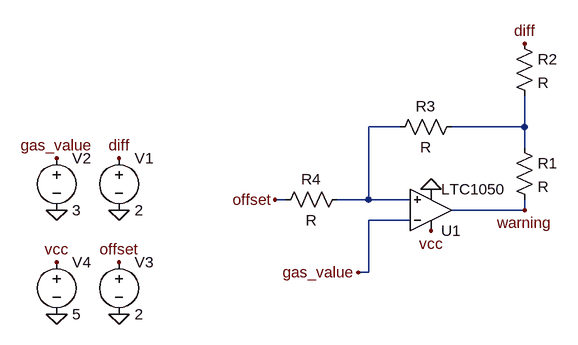
[diagram p0: schematic Draft2.asc]
Draft2.asc, the LTspice schematic file:
Version 4
SHEET 1 880 680
WIRE 160 -16 112 -16
WIRE 352 -16 352 -64
WIRE 352 -16 240 -16
WIRE 352 16 352 -16
WIRE -16 96 -32 96
WIRE 112 96 112 -16
WIRE 112 96 64 96
WIRE 176 96 112 96
WIRE 352 112 352 96
WIRE 352 112 240 112
WIRE 176 128 112 128
WIRE 112 208 112 128
WIRE 112 208 96 208
FLAG 96 208 gas_value
FLAG -32 96 offset
FLAG 352 -144 diff
FLAG 352 112 warning
FLAG -272 112 0
FLAG -272 32 diff
FLAG -368 112 0
FLAG -368 32 gas_value
FLAG -272 272 0
FLAG -272 192 offset
FLAG -368 272 0
FLAG -368 192 vcc
FLAG 208 144 vcc
FLAG 208 80 0
SYMBOL Opamps\\LTC1050 208 176 M180
SYMATTR InstName U1
SYMBOL res 336 0 R0
SYMATTR InstName R1
SYMBOL res 336 -160 R0
SYMATTR InstName R2
SYMBOL res 144 0 R270
WINDOW 0 32 56 VTop 2
WINDOW 3 0 56 VBottom 2
SYMATTR InstName R3
SYMBOL res -32 112 R270
WINDOW 0 32 56 VTop 2
WINDOW 3 0 56 VBottom 2
SYMATTR InstName R4
SYMBOL voltage -272 16 R0
WINDOW 123 0 0 Left 2
WINDOW 39 0 0 Left 2
SYMATTR InstName V1
SYMATTR Value 2
SYMBOL voltage -368 16 R0
SYMATTR InstName V2
SYMATTR Value 3
SYMBOL voltage -272 176 R0
SYMATTR InstName V3
SYMATTR Value 2
SYMBOL voltage -368 176 R0
SYMATTR InstName V4
SYMATTR Value 5

The netlist it stands for:
* Draft2.asc
XU1 N001 gas_value vcc 0 warning LTC1050  ; pins In+ In- V+ V- OUT
R1 N002 warning R
R2 diff N002 R
R3 N001 N002 R
R4 offset N001 R
V1 diff 0 2
V2 gas_value 0 3
V3 offset 0 2
V4 vcc 0 5
.lib LTC.lib
.backanno
.end